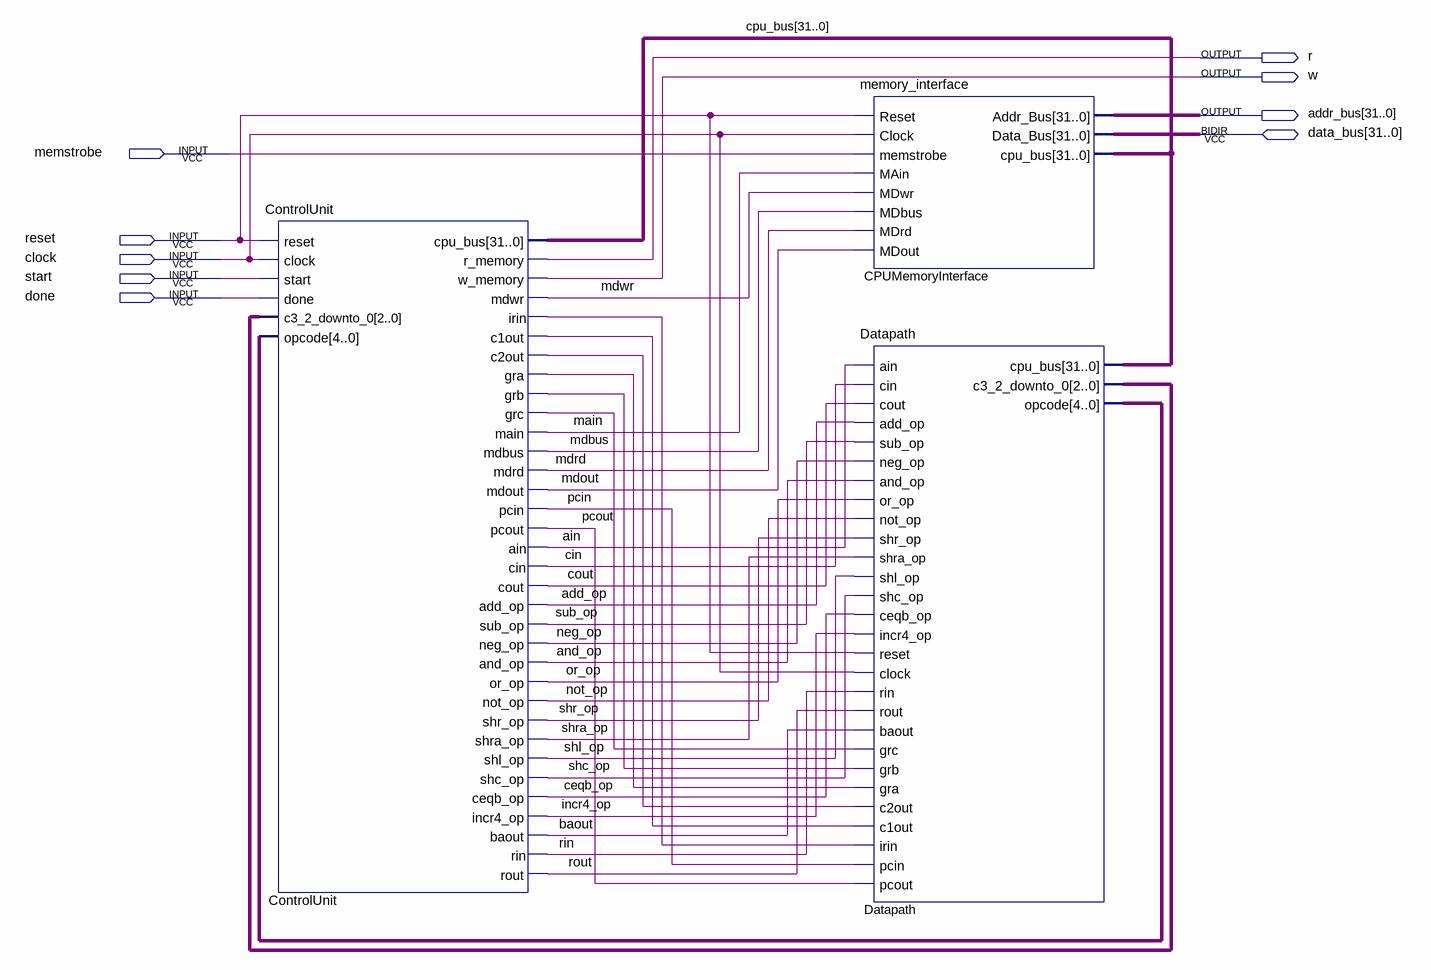
[diagram p0: schematic sheet]
// Quartus schematic CPU.bdf as structural Verilog: 3 symbols, 9 pins
module CPU (
  input  memstrobe,
  input  reset,
  input  clock,
  input  start,
  input  done,
  inout  [31:0] data_bus,
  output r,
  output w,
  output [31:0] addr_bus
);

  wire add_op, ain, and_op, baout, ceqb_op, cin, ControlUnit_c1out, ControlUnit_c2out, ControlUnit_gra,
       ControlUnit_grb, ControlUnit_grc, ControlUnit_irin, cout, incr4_op, main, mdbus, mdout, mdrd, mdwr,
       neg_op, not_op, or_op, pcin, pcout, rin, rout, shc_op, shl_op, shr_op, shra_op, sub_op;
  wire [2:0] Datapath_c3_2_downto_0;
  wire [4:0] Datapath_opcode;
  wire [31:0] cpu_bus;

  ControlUnit ControlUnit (
    .reset(reset), .clock(clock), .start(start), .done(done), .c3_2_downto_0(Datapath_c3_2_downto_0),
    .opcode(Datapath_opcode), .r_memory(r), .w_memory(w), .mdwr(mdwr), .irin(ControlUnit_irin),
    .c1out(ControlUnit_c1out), .c2out(ControlUnit_c2out), .gra(ControlUnit_gra), .grb(ControlUnit_grb),
    .grc(ControlUnit_grc), .main(main), .mdbus(mdbus), .mdrd(mdrd), .mdout(mdout), .pcin(pcin),
    .pcout(pcout), .ain(ain), .cin(cin), .cout(cout), .add_op(add_op), .sub_op(sub_op), .neg_op(neg_op),
    .and_op(and_op), .or_op(or_op), .not_op(not_op), .shr_op(shr_op), .shra_op(shra_op), .shl_op(shl_op),
    .shc_op(shc_op), .ceqb_op(ceqb_op), .incr4_op(incr4_op), .baout(baout), .rin(rin), .rout(rout),
    .cpu_bus(cpu_bus));
  memory_interface CPUMemoryInterface (
    .Reset(reset), .Clock(clock), .memstrobe(memstrobe), .MAin(main), .MDwr(mdwr), .MDbus(mdbus),
    .MDrd(mdrd), .MDout(mdout), .Addr_Bus(addr_bus), .Data_Bus(data_bus), .cpu_bus(cpu_bus));
  Datapath Datapath (
    .ain(ain), .cin(cin), .cout(cout), .add_op(add_op), .sub_op(sub_op), .neg_op(neg_op), .and_op(and_op),
    .or_op(or_op), .not_op(not_op), .shr_op(shr_op), .shra_op(shra_op), .shl_op(shl_op), .shc_op(shc_op),
    .ceqb_op(ceqb_op), .incr4_op(incr4_op), .reset(reset), .clock(clock), .rin(rin), .rout(rout),
    .baout(baout), .grc(ControlUnit_grc), .grb(ControlUnit_grb), .gra(ControlUnit_gra),
    .c2out(ControlUnit_c2out), .c1out(ControlUnit_c1out), .irin(ControlUnit_irin), .pcin(pcin),
    .pcout(pcout), .c3_2_downto_0(Datapath_c3_2_downto_0), .opcode(Datapath_opcode), .cpu_bus(cpu_bus));
endmodule
